# Altium schematic sheet CAN_TxRx.SchDoc
size A; SheetNumber: 5; SheetTotal: 7
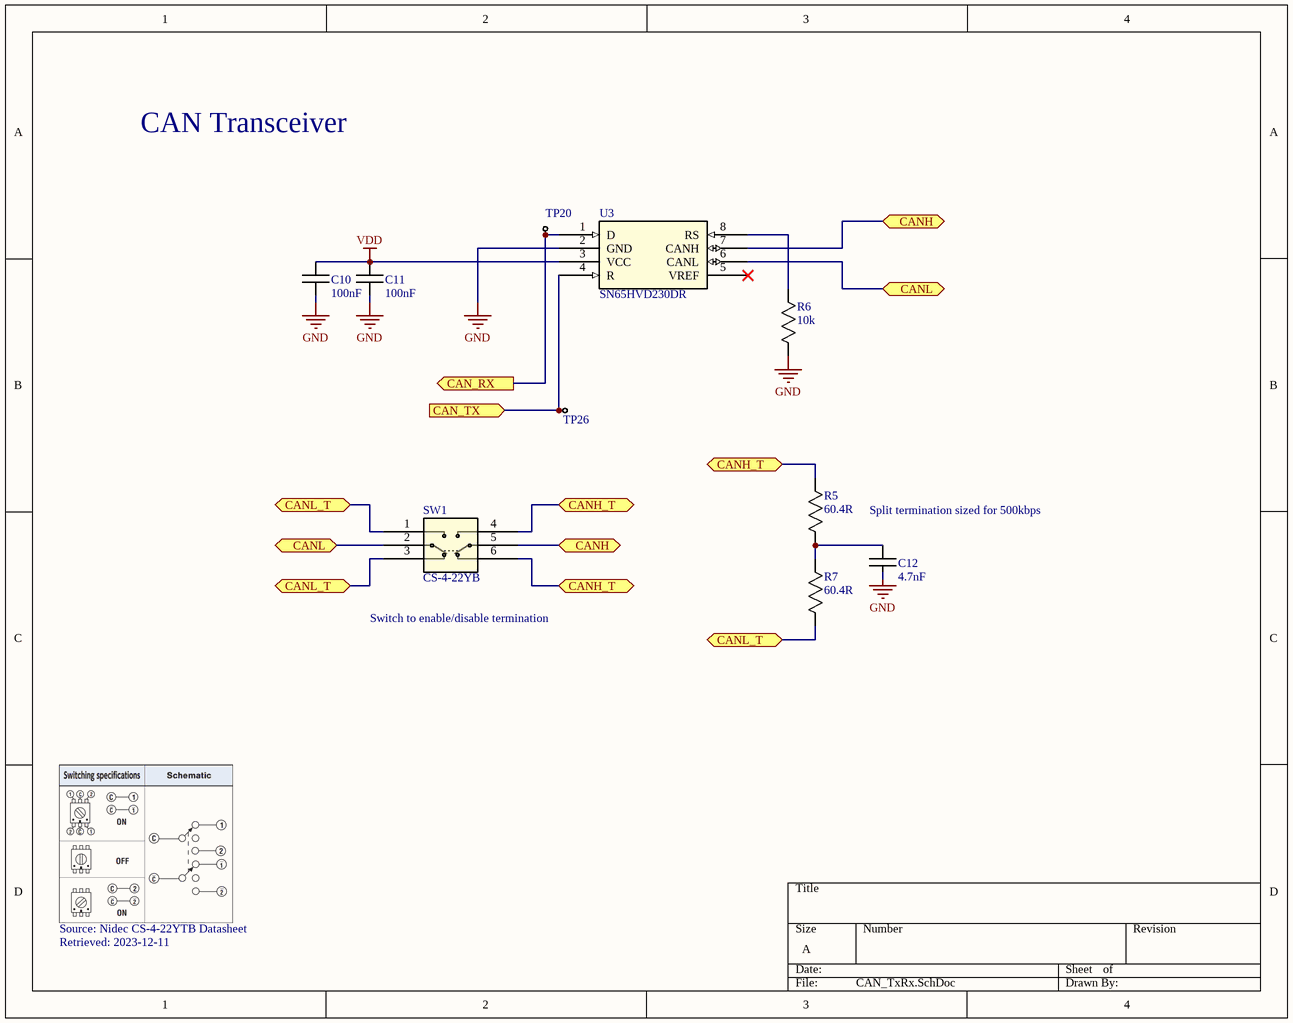
[diagram p0: CAN_TxRx.SchDoc]

## Parts
C10  100nF  [CAP0805]
C11  100nF  [CAP0805]
C12  4.7nF  [C0603]
R5  60.4R  [R0603]
R6  10k  [R0603]
R7  60.4R  [R0603]
SW1  CS-4-22YB  [CS-4-22YB_NDC]
TP20  1mm Test Point  [TP_1MM]  (value not drawn)
TP26  1mm Test Point  [TP_1MM]  (value not drawn)
U3  SN65HVD230DR  [SOIC_8]

## Ports
CAN_RX (out, see Microcontroller_STM32F04[1B]), CAN_TX (in, see Microcontroller_STM32F04[1B]), CANH (bidir, see BoardIF[2B], CAN_TxRx[2C]), CANH (bidir, see BoardIF[2B], CAN_TxRx[3A]), CANH_T (bidir, see CAN_TxRx[2B], CAN_TxRx[2C]), CANH_T (bidir, see CAN_TxRx[2B], CAN_TxRx[3B]), CANH_T (bidir, see CAN_TxRx[2C], CAN_TxRx[3B]), CANL (bidir, see BoardIF[2B], CAN_TxRx[1C]), CANL (bidir, see BoardIF[2B], CAN_TxRx[3B]), CANL_T (bidir, see CAN_TxRx[1B], CAN_TxRx[1C]), CANL_T (bidir, see CAN_TxRx[1B], CAN_TxRx[3C]), CANL_T (bidir, see CAN_TxRx[1C], CAN_TxRx[3C])

## Nets
GND: C10.2 C11.2 C12.2 R6.2 U3.2(GND)
VDD: C10.1 C11.1 U3.3(VCC)
CAN_RX: TP20.1 U3.1(D) ; port CAN_RX
CAN_TX: TP26.1 U3.4(R) ; port CAN_TX
CANH: SW1.5 U3.7(CANH) ; port CANH
CANH_T: R5.1 SW1.4 SW1.6 ; port CANH_T
CANL: SW1.2 U3.6(CANL) ; port CANL
CANL_T: R7.2 SW1.1 SW1.3 ; port CANL_T
NetC12_1: C12.1 R5.2 R7.1
NetR6_1: R6.1 U3.8(RS)

Not connected (* = marked no-connect by the designer): U3 5(VREF)*

## Notes on the sheet
- CAN Transceiver
- Split termination sized for 500kbps
- Switch to enable/disable termination
- Source: Nidec CS-4-22YTB Datasheet
- Retrieved: 2023-12-11

## Library data of the parts
C10 C11 = CC0805KRX7R9BB104: Multilayer Ceramic Capacitor, 0.1 uF, 50 V, ± 10%, X7R, 0805 [2012 Metric]; Manufacturer: Yageo; Value: 100nF 50V; Voltage: 50V; Insulation Resistance: 100GR; Supplier: Digi-Key; Supplier Part Number: 311-1140-1-ND; Manufacturer Part Number: CC0805KRX7R9BB104; RoHS: Yes; Category: Ceramic Capacitors; Stock: 6426664; Pricing: 1=0.1, 10=0.07, 50=0.0418, 100=0.0329, 500=0.02428, 1000=0.0201 (USD); Mounting Technology: Surface Mount; Case/Package: 0805; Pins: 2; Case Code (Metric): 2012; Case Code (Imperial): 0805; Material: Ceramic; Min Operating Temperature: -55°C; Max Operating Temperature: 125°C; Tolerance: 10%; Dielectric: X7R; Packaging: Tape and Reel; Voltage Rating: 50V; Package Quantity: 4000; Termination: SMD/SMT; Series: CC; Length: 2mm; Height: 0.85mm; Depth: 1.25mm; Radiation Hardening: No; RoHS Compliant: Yes; Reach SVHC Compliant: No; Lead Free: Lead Free; Halogen Free: Halogen Free; ComponentLink1URL: https://datasheet.ciiva.com/11786/0900766b80d84f1d-11786009.pdf?src-supplier=Rs; ComponentLink1Description: https://datasheet.ciiva.com/11786/0900766b80d84f1d-11786009.pdf?src-supplier=Rs; ComponentLink2URL: https://datasheet.ciiva.com/46393/1734573-46393307.pdf?src-supplier=Element14; ComponentLink2Description: https://datasheet.ciiva.com/46393/1734573-46393307.pdf?src-supplier=Element14; ComponentLink3URL: https://datasheet.ciiva.com/155/mlccorderingcode-155930.pdf?src-supplier=Digi-Key; ComponentLink3Description: https://datasheet.ciiva.com/155/mlccorderingcode-155930.pdf?src-supplier=Digi-Key; ComponentLink4URL: https://datasheet.ciiva.com/155/mlccorderingcode-155929.pdf?src-supplier=Digi-Key; ComponentLink4Description: https://datasheet.ciiva.com/155/mlccorderingcode-155929.pdf?src-supplier=Digi-Key; ComponentLink5URL: https://datasheet.ciiva.com/155/mlccorderingcode-155931.pdf?src-supplier=Digi-Key; ComponentLink5Description: https://datasheet.ciiva.com/155/mlccorderingcode-155931.pdf?src-supplier=Digi-Key; ComponentLink6URL: https://datasheet.ciiva.com/11464/upy-gphc-x7r-6-3v-to-50v-8-11464757.pdf?src-supplier=Avnet; ComponentLink6Description: https://datasheet.ciiva.com/11464/upy-gphc-x7r-6-3v-to-50v-8-11464757.pdf?src-supplier=Avnet; ComponentLink7URL: https://datasheet.ciiva.com/28450/1489800-28450805.pdf?src-supplier=Element14; ComponentLink7Description: https://datasheet.ciiva.com/28450/1489800-28450805.pdf?src-supplier=Element14; ComponentLink8URL: https://datasheet.ciiva.com/29242/445210-da-01-en-kerko-chip-0805-x7r-0-1uf-10proz-50vg-29242074.pdf?src-supplier=Conrad; ComponentLink8Description: https://datasheet.ciiva.com/29242/445210-da-01-en-kerko-chip-0805-x7r-0-1uf-10proz-50vg-29242074.pdf?src-supplier=Conrad; LCSC Part#: C49678
C12 = C0603C472K1TACAUTO: Cap Cer 0603 4.7NF 100VDC X8G; Manufacturer: KEMET; Supplier: Digi-Key; Supplier Part Number: 399-C0603C472K1TACAUTOCT-ND; Manufacturer Part Number: C0603C472K1TACAUTO; RoHS: No; Category: Ceramic Capacitors; Stock: 10636; Pricing: 1=0.42, 10=0.284, 50=0.2264, 100=0.1869, 500=0.14604, 1000=0.12414 (USD); Value: 4.7nF 100V; LCSC Part#: C3882427; Package: 0603
R5 R7 = RC0603FR-0760R4L: Res Thick Film 0603 60.4 Ohm 1% 0.1W(1/10W) ±100ppm/C Pad SMD T/R; Manufacturer: Yageo; Power Rating: 100mW; Voltage Rating: 50V; Temperature Coefficient: 100ppm/°C; Supplier: Digi-Key; Supplier Part Number: 311-60.4HRCT-ND; Manufacturer Part Number: RC0603FR-0760R4L; RoHS: Yes; Category: Chip SMD Resistors; Stock: 143040; Pricing: 1=0.1, 10=0.019, 50=0.0112, 100=0.0093, 500=0.00622, 1000=0.00532 (USD); Case/Package: 0603; Case Code (Imperial): 0603; Case Code (Metric): 1608; Min Operating Temperature: -55°C; Max Operating Temperature: 155°C; Packaging: Tape and Reel; Value: 60.4R; Tolerance: 1%; Termination: SMD/SMT; Voltage Rating (DC): 50V; Features: Moisture Resistant; Series: RC; Max Power Dissipation: 100mW; Number of Terminations: 2; Length: 1.6mm; Width: 0.8mm; Height: 0.45mm; Lead Free: Lead Free; RoHS Compliant: Yes; ComponentLink1URL: https://datasheet.ciiva.com/12558/rc0603-272842-12558933.pdf?src-supplier=Mouser; ComponentLink1Description: https://datasheet.ciiva.com/12558/rc0603-272842-12558933.pdf?src-supplier=Mouser; LCSC Part#: C245987
R6 = RC0603JR-0710KL: SMD Chip Resistor, 10 kOhm, ± 5%, 100 mW, 0603 [1608 Metric], Thick Film, General Purpose; Manufacturer: Yageo; Value: 10kR; Temperature Coefficient: 100ppm/°C; Max Power Dissipation: 100mW; Voltage Rating (AC): 50V; Supplier: Digi-Key; Supplier Part Number: 311-10KGRCT-ND; Manufacturer Part Number: RC0603JR-0710KL; RoHS: Yes; Category: Chip SMD Resistors; Stock: 3736571; Pricing: 1=0.1, 10=0.015, 50=0.0092, 100=0.0076, 500=0.00512, 1000=0.00437 (USD); Case/Package: 0603; Min Operating Temperature: -55°C; Max Operating Temperature: 155°C; Tolerance: 5%; Number of Terminations: 2; Series: RC; Reach SVHC Compliant: 4187SVHC; RoHS Compliant: Yes; ComponentLink1URL: https://datasheet.ciiva.com/2452/pyu-rc-group-51-rohs-l-10-2452848.pdf?src-supplier=Digi-Key; ComponentLink1Description: https://datasheet.ciiva.com/2452/pyu-rc-group-51-rohs-l-10-2452848.pdf?src-supplier=Digi-Key; LCSC Part#: C99198
SW1 = CS-4-22YTB: Switch Rotary ON OFF ON DPDT 2 Flush Screwdriver Gull Wing 0.1A 16VAC 16VDC 0.5VA T/R; Mfr_Name: Nidec Copal Electronics; Manufacturer: Nidec Copal; Body Material: Epoxy; Number of Positions: 2; Voltage Rating (DC): 16V; Electrical Life: 200Cycles; Washable: Yes; Copyright: Copyright (C) 2023 Ultra Librarian. All rights reserved.; Manufacturer_Part_Number: CS-4-22YB; RefDes: RefDes; Type: DEV; Supplier: Digi-Key; Supplier Part Number: 563-1040-1-ND; Manufacturer Part Number: CS-4-22YTB; RoHS: Yes; Category: DIP Switches; Stock: 6353; Pricing: 1=2.85, 10=2.683, 25=2.4392, 100=2.1139, 250=1.91648 (USD); Mounting Technology: Surface Mount; Contact Material: Copper Alloy; Contact Plating: Gold; Min Operating Temperature: -25°C; Max Operating Temperature: 70°C; Throw Configuration: DPDT; Orientation: Vertical; Packaging: Cut Tape; Termination: Gull Wing; Series: CS-4; Actuator Type: Rotary; Lead Free: Lead Free; RoHS Compliant: Yes; ComponentLink1URL: https://datasheet.ciiva.com/2864/cs-4-2864257.pdf?src-supplier=Digi-Key; ComponentLink1Description: https://datasheet.ciiva.com/2864/cs-4-2864257.pdf?src-supplier=Digi-Key; ComponentLink2URL: https://datasheet.ciiva.com/2864/cs-4-2864258.pdf?src-supplier=Digi-Key; ComponentLink2Description: https://datasheet.ciiva.com/2864/cs-4-2864258.pdf?src-supplier=Digi-Key; ComponentLink3URL: https://datasheet.ciiva.com/2864/cs-4-2864259.pdf?src-supplier=Digi-Key; ComponentLink3Description: https://datasheet.ciiva.com/2864/cs-4-2864259.pdf?src-supplier=Digi-Key; LCSC Part#: C2921707; Value: CS-4-22YTB
TP20 TP26 = TestPoint_1mm
U3 = SN65HVD230DR: EAR99 65HVD230 Cut Tape (CT) CANbus interface driver 3.3V 17mA 72.603129mg 1Mbps; Manufacturer: Texas Instruments; Min Supply Voltage: 3V; Max Supply Voltage: 3.6V; Number of Receivers: 1; Number of I/Os: 2; Slew Rate: 15V/µs; Supplier: Digi-Key; Supplier Part Number: 296-11654-6-ND; Manufacturer Part Number: SN65HVD230DR; RoHS: Yes; Category: Interface ICs; Stock: 82408; Pricing: 1=2.5, 10=2.248, 25=2.1208, 100=1.8071, 250=1.6968, 500=1.4847, 1000=1.23018 (USD); Case/Package: D; Pins: 8; Weight: 0.002561oz; Min Operating Temperature: -40°C; Max Operating Temperature: 85°C; Data Rate: 1Mbps; Packaging: Tape and Reel; Package Quantity: 1; Operating Supply Voltage: 3.3V; Number of Transceivers: 1; Number of Drivers: 1; Series: -; Supply Current: 17mA; Number of Transmit Buffers: 1; Number of Receive Buffers: 1; Termination: SMD/SMT; Length: 4.9mm; Width: 3.91mm; Height: 1.75mm; Thickness: 1.58mm; Radiation Hardening: No; Lead Free: Lead Free; RoHS Compliant: Yes; Reach SVHC Compliant: No; ComponentLink1URL: https://datasheet.ciiva.com/3303/slos346k-3303008.pdf?src-supplier=Avnet; ComponentLink1Description: https://datasheet.ciiva.com/3303/slos346k-3303008.pdf?src-supplier=Avnet; ComponentLink2URL: https://datasheet.ciiva.com/28652/1695240-28652369.pdf?src-supplier=Element14; ComponentLink2Description: https://datasheet.ciiva.com/28652/1695240-28652369.pdf?src-supplier=Element14; ComponentLink3URL: https://datasheet.ciiva.com/4781/sn65hvd230-86923-4781328.pdf?src-supplier=Mouser; ComponentLink3Description: https://datasheet.ciiva.com/4781/sn65hvd230-86923-4781328.pdf?src-supplier=Mouser; ComponentLink4URL: https://datasheet.ciiva.com/27052/1495682-27052294.pdf?src-supplier=Jameco; ComponentLink4Description: https://datasheet.ciiva.com/27052/1495682-27052294.pdf?src-supplier=Jameco; ComponentLink5URL: https://datasheet.ciiva.com/1705/sn65hvd230-1705286.pdf?src-supplier=Digi-Key; ComponentLink5Description: https://datasheet.ciiva.com/1705/sn65hvd230-1705286.pdf?src-supplier=Digi-Key; ComponentLink6URL: https://datasheet.ciiva.com/1705/sn65hvd230-1705287.pdf?src-supplier=Digi-Key; ComponentLink6Description: https://datasheet.ciiva.com/1705/sn65hvd230-1705287.pdf?src-supplier=Digi-Key; ComponentLink7URL: https://datasheet.ciiva.com/1705/sn65hvd230-1705288.pdf?src-supplier=Digi-Key; ComponentLink7Description: https://datasheet.ciiva.com/1705/sn65hvd230-1705288.pdf?src-supplier=Digi-Key; ComponentLink8URL: https://datasheet.ciiva.com/22694/1887486-22694362.pdf?src-supplier=Element14; ComponentLink8Description: https://datasheet.ciiva.com/22694/1887486-22694362.pdf?src-supplier=Element14; ComponentLink9URL: https://datasheet.ciiva.com/15150/getdatasheetpartid-393721-15150028.pdf?src-supplier=Verical; ComponentLink9Description: https://datasheet.ciiva.com/15150/getdatasheetpartid-393721-15150028.pdf?src-supplier=Verical; LCSC Part#: C12084; Value: SN65HVD230DR